# Altium project DARKYDEN.PrjPcb (part 9 of 9)
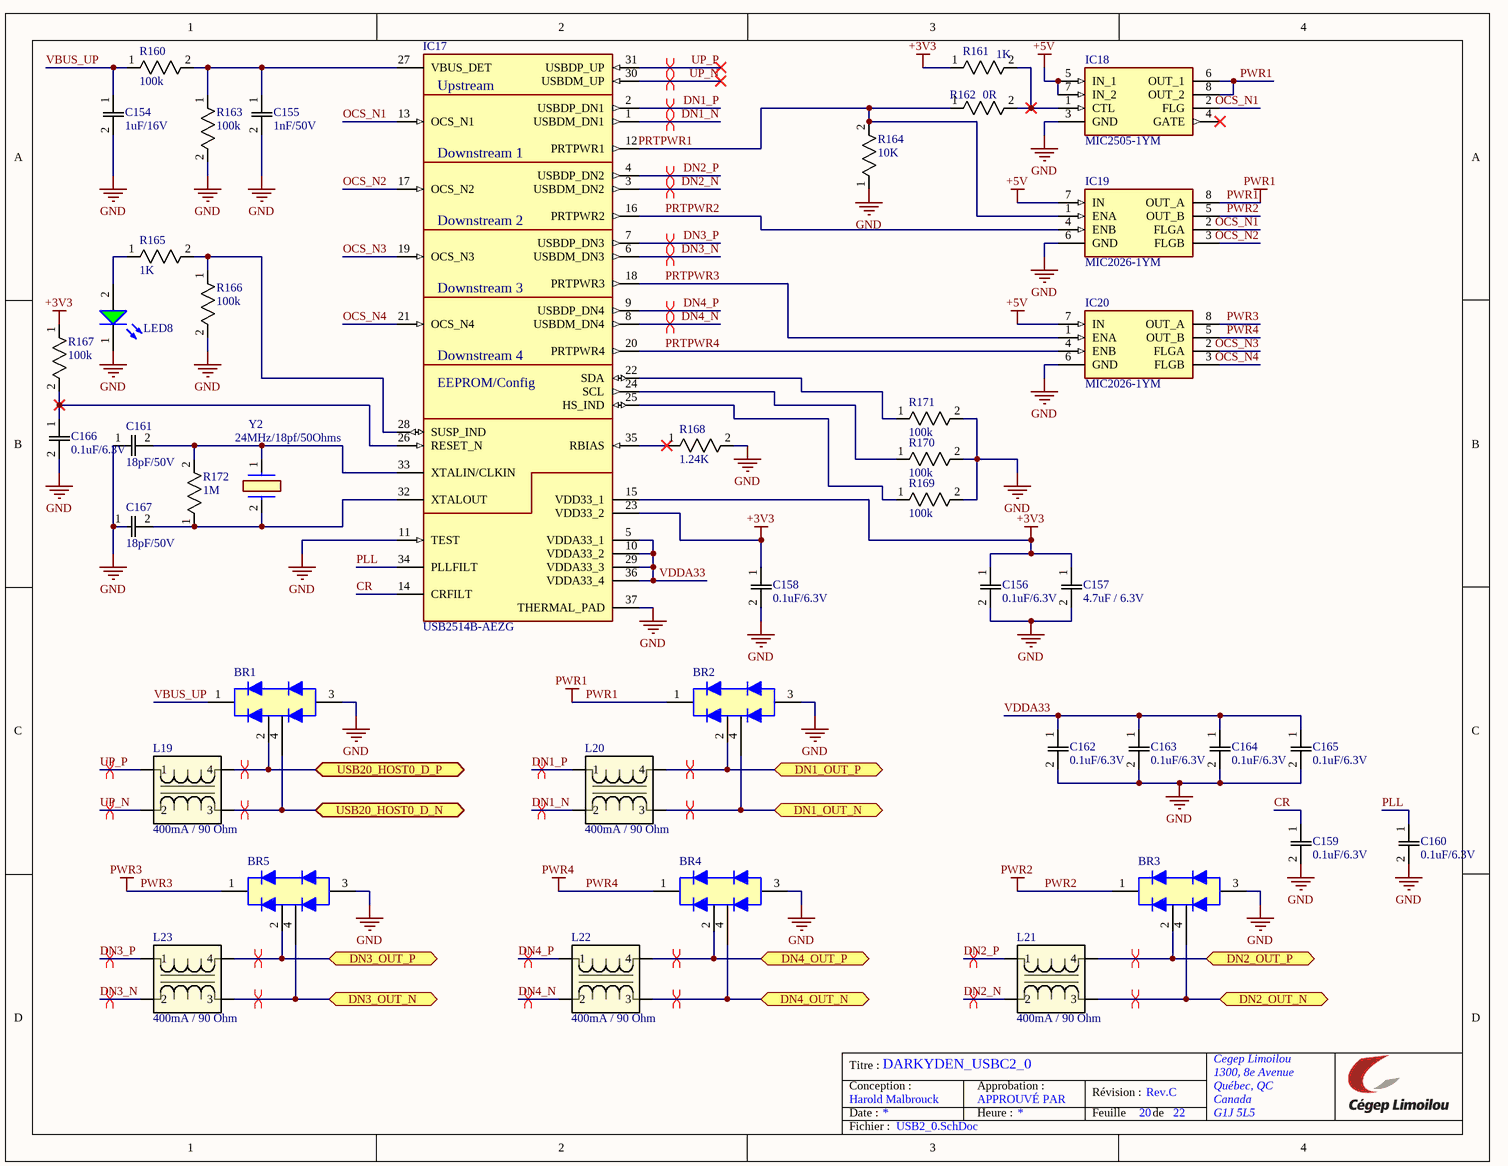
[diagram p12: USB2_0.SchDoc]

## Nets that join several sheets
+3V3: ETHERNET (R14.2 R15.2), Power (9 pins), eDP (C21.2 U13.1), USB2_0 (7 pins)
+3V3_WIFI: POWER_PCie (7 pins), WIFI (WIFI.2 WIFI.4 WIFI.72 WIFI.74)
+5V: Power (7 pins), USB2_0 (IC18.5 IC18.7 IC19.7 IC20.7)
+12: POWER_PCie (R98.1 R99.1), eDP (eDP1.10 eDP1.11 eDP1.12), 12V_FROM_BATTERY (9 pins)
AGND: ETHERNET (8 pins), POWER_PCie (18 pins), Power (24 pins), WIFI (14 pins), CONNECTEUR_2 (32 pins), eDP (18 pins), POWERSYSTEM (59 pins), BATTERY_GESTION (25 pins), 12V_FROM_BATTERY (22 pins), USB2_0 (32 pins)
NetR79_1: POWER_PCie (R93.1 R94.1), Power (R79.1 R80.1 R84.1 R85.1)
PACK+: POWERSYSTEM (7 pins), BATTERY_GESTION (10 pins)
VCC_SYS: POWERSYSTEM (8 pins), 12V_FROM_BATTERY (10 pins)
PMIC_EXT_EN_OUT: POWER_PCie (R95.1 R100.1), Power (R81.1 R86.1)